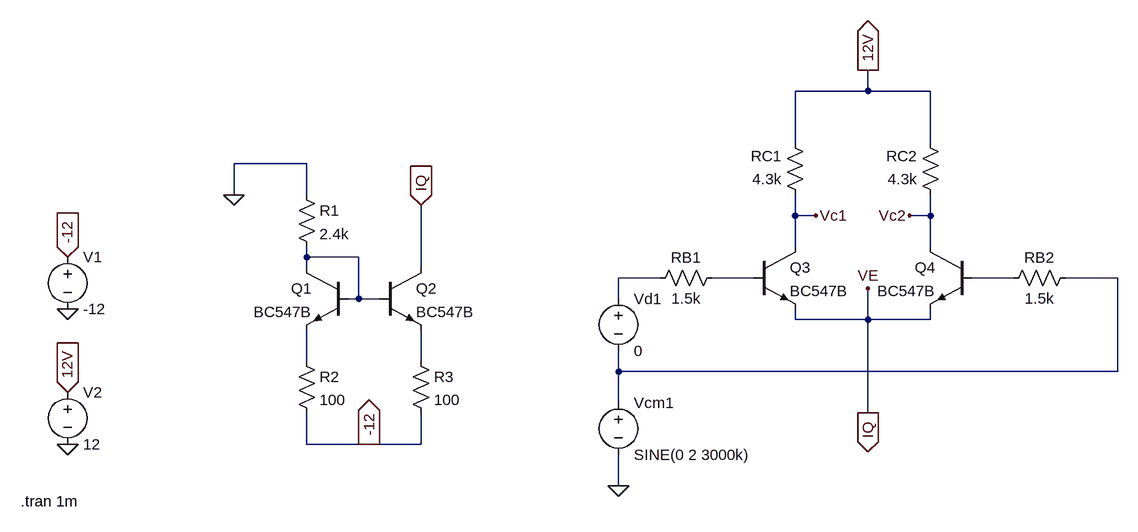
[diagram p0: schematic lab6.2.2b.asc]
lab6.2.2b.asc, the LTspice schematic file:
Version 4
SHEET 1 1060 680
WIRE 672 -320 672 -352
WIRE 672 -320 560 -320
WIRE 768 -320 672 -320
WIRE 560 -240 560 -320
WIRE 768 -240 768 -320
WIRE -192 -208 -304 -208
WIRE -304 -160 -304 -208
WIRE -192 -160 -192 -208
WIRE 560 -128 560 -160
WIRE 592 -128 560 -128
WIRE 768 -128 768 -160
WIRE 768 -128 736 -128
WIRE 560 -80 560 -128
WIRE 768 -80 768 -128
WIRE -192 -64 -192 -80
WIRE -112 -64 -192 -64
WIRE -192 -48 -192 -64
WIRE -16 -48 -16 -144
WIRE 352 -32 288 -32
WIRE 496 -32 432 -32
WIRE 896 -32 832 -32
WIRE 1056 -32 976 -32
WIRE -112 0 -112 -64
WIRE -112 0 -128 0
WIRE -80 0 -112 0
WIRE 288 0 288 -32
WIRE 560 32 560 16
WIRE 672 32 672 -16
WIRE 672 32 560 32
WIRE 768 32 768 16
WIRE 768 32 672 32
WIRE -192 96 -192 48
WIRE -16 96 -16 48
WIRE 288 112 288 80
WIRE 1056 112 1056 -32
WIRE 1056 112 288 112
WIRE 288 160 288 112
WIRE 672 176 672 32
WIRE -192 224 -192 176
WIRE -96 224 -192 224
WIRE -16 224 -16 176
WIRE -16 224 -96 224
WIRE 288 288 288 240
FLAG -304 -160 0
FLAG -560 16 0
FLAG -560 -64 -12
IOPIN -560 -64 In
FLAG -96 224 -12
IOPIN -96 224 Out
FLAG 288 288 0
FLAG -560 224 0
FLAG -560 144 12V
IOPIN -560 144 In
FLAG 672 -352 12V
IOPIN 672 -352 Out
FLAG -16 -144 IQ
IOPIN -16 -144 In
FLAG 672 176 IQ
IOPIN 672 176 Out
FLAG 592 -128 Vc1
FLAG 736 -128 Vc2
FLAG 672 -16 VE
SYMBOL res -208 -176 R0
SYMATTR InstName R1
SYMATTR Value 2.4k
SYMBOL npn -128 -48 M0
SYMATTR InstName Q1
SYMATTR Value BC547B
SYMBOL npn -80 -48 R0
SYMATTR InstName Q2
SYMATTR Value BC547B
SYMBOL res -208 80 R0
SYMATTR InstName R2
SYMATTR Value 100
SYMBOL res -32 80 R0
SYMATTR InstName R3
SYMATTR Value 100
SYMBOL voltage -560 -80 R0
SYMATTR InstName V1
SYMATTR Value -12
SYMBOL npn 496 -80 R0
SYMATTR InstName Q3
SYMATTR Value BC547B
SYMBOL npn 832 -80 M0
SYMATTR InstName Q4
SYMATTR Value BC547B
SYMBOL res 448 -48 R90
WINDOW 0 0 56 VBottom 2
WINDOW 3 32 56 VTop 2
SYMATTR InstName RB1
SYMATTR Value 1.5k
SYMBOL res 992 -48 R90
WINDOW 0 0 56 VBottom 2
WINDOW 3 32 56 VTop 2
SYMATTR InstName RB2
SYMATTR Value 1.5k
SYMBOL res 576 -144 R180
WINDOW 0 36 76 Left 2
WINDOW 3 36 40 Left 2
SYMATTR InstName RC1
SYMATTR Value 4.3k
SYMBOL res 784 -144 R180
WINDOW 0 36 76 Left 2
WINDOW 3 36 40 Left 2
SYMATTR InstName RC2
SYMATTR Value 4.3k
SYMBOL voltage 288 -16 R0
WINDOW 123 0 0 Left 0
WINDOW 39 0 0 Left 0
SYMATTR InstName Vd1
SYMATTR Value 0
SYMBOL voltage 288 144 R0
WINDOW 123 0 0 Left 0
WINDOW 39 0 0 Left 0
SYMATTR InstName Vcm1
SYMATTR Value SINE(0 2 3000k)
SYMBOL voltage -560 128 R0
SYMATTR InstName V2
SYMATTR Value 12
TEXT -632 312 Left 2 !.tran 1m

The netlist it stands for:
* lab6.2.2b.asc
R1 0 N001 2.4k
Q1 N001 N001 N006 0 BC547B
Q2 VE N001 N007 0 BC547B
R2 N006 -12 100
R3 N007 -12 100
V1 -12 0 -12
Q3 Vc1 N003 VE 0 BC547B
Q4 Vc2 N004 VE 0 BC547B
RB1 N003 N002 1.5k
RB2 N005 N004 1.5k
RC1 Vc1 12V 4.3k
RC2 Vc2 12V 4.3k
Vd1 N002 N005 0
Vcm1 N005 0 SINE(0 2 3000k)
V2 12V 0 12
.model NPN NPN
.model PNP PNP
.lib standard.bjt
.tran 1m
.backanno
.end